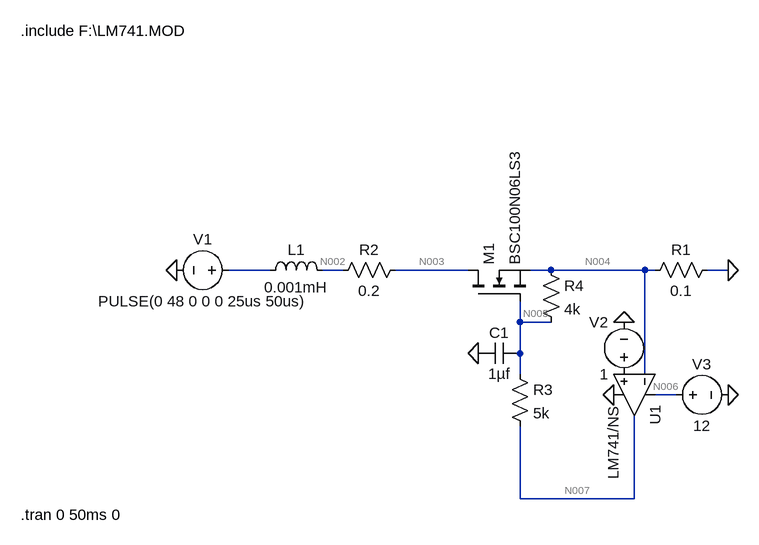
[diagram p0: schematic RL- OP AMP CURRENT CONTROL FOR DC.asc]
RL- OP AMP CURRENT CONTROL FOR DC.asc, the LTspice schematic file:
Version 4
SHEET 1 1348 680
WIRE 288 112 224 112
WIRE 400 112 368 112
WIRE 592 112 480 112
WIRE 720 112 688 112
WIRE 864 112 720 112
WIRE 880 112 864 112
WIRE 992 112 960 112
WIRE 672 192 672 160
WIRE 720 192 672 192
WIRE 672 240 672 192
WIRE 672 272 672 240
WIRE 864 272 864 112
WIRE 912 304 880 304
WIRE 672 464 672 352
WIRE 848 464 848 336
WIRE 848 464 672 464
FLAG 144 112 0
FLAG 992 304 0
FLAG 816 304 0
FLAG 832 192 0
FLAG 992 112 0
FLAG 608 240 0
SYMBOL OpAmps\\opamp2 912 304 R90
SYMATTR InstName U1
SYMATTR Value LM741/NS
SYMBOL nmos 592 160 R270
SYMATTR InstName M1
SYMATTR Value BSC100N06LS3
SYMBOL res 976 96 R90
WINDOW 0 0 56 VBottom 2
WINDOW 3 32 56 VTop 2
SYMATTR InstName R1
SYMATTR Value 0.1
SYMBOL res 496 96 R90
WINDOW 0 0 56 VBottom 2
WINDOW 3 32 56 VTop 2
SYMATTR InstName R2
SYMATTR Value 0.2
SYMBOL voltage 240 112 R90
WINDOW 0 -32 56 VBottom 2
WINDOW 3 32 56 VTop 2
WINDOW 123 0 0 Left 0
WINDOW 39 0 0 Left 0
SYMATTR InstName V1
SYMATTR Value PULSE(0 48 0 0 0 25us 50us)
SYMBOL voltage 896 304 R270
WINDOW 0 32 56 VTop 2
WINDOW 3 -32 56 VBottom 2
WINDOW 123 0 0 Left 0
WINDOW 39 0 0 Left 0
SYMATTR InstName V3
SYMATTR Value 12
SYMBOL voltage 832 288 R180
WINDOW 0 24 96 Left 2
WINDOW 3 24 16 Left 2
WINDOW 123 0 0 Left 0
WINDOW 39 0 0 Left 0
SYMATTR InstName V2
SYMATTR Value 1
SYMBOL ind 272 128 R270
WINDOW 0 32 56 VTop 2
WINDOW 3 5 56 VBottom 2
SYMATTR InstName L1
SYMATTR Value 0.001mH
SYMBOL res 656 256 R0
SYMATTR InstName R3
SYMATTR Value 5k
SYMBOL res 704 96 R0
SYMATTR InstName R4
SYMATTR Value 4k
SYMBOL cap 672 224 R90
WINDOW 0 0 32 VBottom 2
WINDOW 3 32 32 VTop 2
SYMATTR InstName C1
SYMATTR Value 1µf
TEXT -96 -256 Left 2 !.include F:\\LM741.MOD
TEXT -96 488 Left 2 !.tran 0 50ms 0

The netlist it stands for:
* RL- OP AMP CURRENT CONTROL FOR DC.asc
XU1 P001 N004 N006 0 N007 LM741/NS  ; pins In+ In- V+ V- OUT
M1 N003 N005 N004 N004 BSC100N06LS3
R1 0 N004 0.1
R2 N003 N002 0.2
V1 N001 0 PULSE(0 48 0 0 0 25us 50us)
V3 N006 0 12
V2 P001 0 1
L1 N001 N002 0.001mH
R3 N005 N007 5k
R4 N004 N005 4k
C1 N005 0 1µf
.model NMOS NMOS
.model PMOS PMOS
.lib standard.mos
.include F:\LM741.MOD
.tran 0 50ms 0
.backanno
.end

* Results of the author's LTspice run, read from the files saved beside the schematic
* Operating Point, zero values left out:
*   V(n004) = 82.63 µV
*   V(p001) = 1 V
*   V(n006) = 12 V
*   V(n007) = 10.93 V
*   V(n003) = 78.35 µV
*   V(n005) = 4.857 V
*   V(n002) = 389.8 nV
*   Id(M1) = -389.8 µA
*   Is(M1) = 389.8 µA
*   I(L1) = -389.8 µA
*   I(R4) = -1.214 mA
*   I(R3) = -1.214 mA
*   I(R2) = 389.8 µA
*   I(R1) = -826.3 µA
*   I(V2) = -2.14 µA
*   I(V3) = -2.616 mA
*   I(V1) = 389.8 µA
*   Ix(u1:1) = 2.14 µA
*   Ix(u1:2) = -1.98 µA
*   Ix(u1:99) = 2.616 mA
*   Ix(u1:50) = -1.402 mA
*   Ix(u1:28) = -1.214 mA